# EAGLE schematic 副機插座 v0.4v1.0 (EAGLE 6.3)
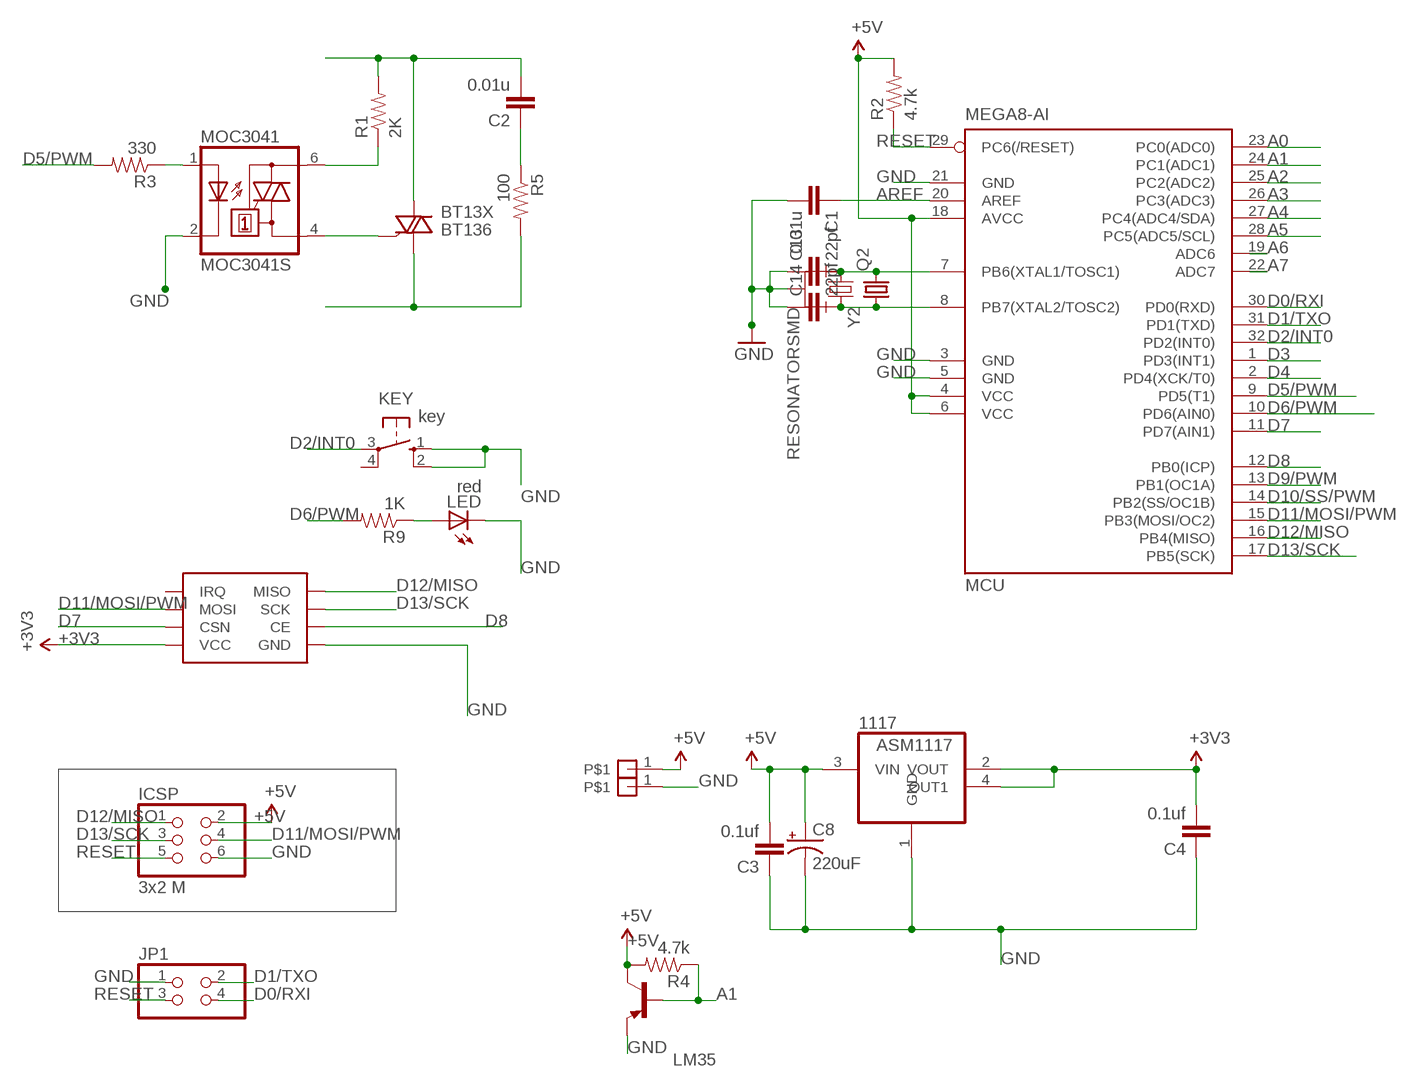
[diagram p0: schematic, sheet 1]

## Parts
1117  ASM1117  [SOT223]
BT13X  BT136  [TO252]
C1  0.01u  CAP0603-CAP  [0603-CAP]
C2  0.01u  C-EU050-024X044  [C050-024X044]
C3  0.1uf  CAP0603-CAP  [0603-CAP]
C4  0.1uf  CAP0603-CAP  [0603-CAP]
C8  220uF  CAP_POL3528  [EIA3528]
C13  22pf  CAP0603-CAP  [0603-CAP]
C14  22pf  CAP0603-CAP  [0603-CAP]
ICSP  3x2 M  PINHD-2X3  [2X03]
JP1  PINHD-2X2  [2X02]
KEY  key  10-XX  [B3F-10XX]
LED  red  LED3MM  [LED3MM]
LM35  -PNP-TO92-E1  [TO92-E1]
MCU  MEGA8-AI  [TQFP32-08]
MOC3041  MOC3041S  [DIL6-SMD]
Q2  CRYSTALHC49S  [HC49/S]
R1  2K  RESISTORPTH1  [AXIAL-0.3]
R2  4.7k  RESISTOR0603-RES  [0603-RES]
R3  330  RESISTOR0603-RES  [0603-RES]
R4  4.7k  RESISTOR0603-RES  [0603-RES]
R5  100  RESISTORPTH1  [AXIAL-0.3]
R9  1K  RESISTOR0603-RES  [0603-RES]
U$3  PIN1  [PIN1]
U$4  PIN1  [PIN1]
U$6  NRF  [NRF]
Y2  RESONATORSMD  [RESONATOR-SMD]

## Nets
+3V3: 1117.2(VOUT) 1117.4(OUT1) C4.2 U$6.P$2(VCC)
+5V: 1117.3(VIN) C3.2 C8.A(+) ICSP.2 LM35.1(C) MCU.4(VCC) MCU.6(VCC) MCU.18(AVCC) R2.2 R4.2 U$3.1
A0: MCU.23(PC0(ADC0))
A1: LM35.2(B) MCU.24(PC1(ADC1)) R4.1
A2: MCU.25(PC2(ADC2))
A3: MCU.26(PC3(ADC3))
A4: MCU.27(PC4(ADC4/SDA))
A5: MCU.28(PC5(ADC5/SCL))
A6: MCU.19(ADC6)
A7: MCU.22(ADC7)
AREF: C1.1 MCU.20(AREF)
D0/RXI: JP1.4 MCU.30(PD0(RXD))
D1/TXO: JP1.2 MCU.31(PD1(TXD))
D2/INT0: KEY.3(P) MCU.32(PD2(INT0))
D3: MCU.1(PD3(INT1))
D4: MCU.2(PD4(XCK/T0))
D5/PWM: MCU.9(PD5(T1)) R3.2
D6/PWM: MCU.10(PD6(AIN0)) R9.2
D7: MCU.11(PD7(AIN1)) U$6.P$4(CSN)
D8: MCU.12(PB0(ICP)) U$6.P$3(CE)
D9/PWM: MCU.13(PB1(OC1A))
D10/SS/PWM: MCU.14(PB2(SS/OC1B))
D11/MOSI/PWM: ICSP.4 MCU.15(PB3(MOSI/OC2)) U$6.P$6(MOSI)
D12/MISO: ICSP.1 MCU.16(PB4(MISO)) U$6.P$7(MISO)
D13/SCK: ICSP.3 MCU.17(PB5(SCK)) U$6.P$5(SCK)
GND: 1117.1(GND) C1.2 C3.1 C4.1 C8.C(-) C13.1 C14.1 ICSP.6 JP1.1 KEY.1(S) KEY.2(S1) LED.K(C) LM35.3(E) MCU.3(GND) MCU.5(GND) MCU.21(GND) MOC3041.2(C) U$4.1 U$6.P$1(GND) Y2.2
IN: BT13X.3(A2) C2.2 R1.P$2
N$1: MOC3041.6(A2) R1.P$1
N$2: BT13X.2(G) MOC3041.4(A1)
N$3: C2.1 R5.P$1
N$15: LED.A R9.1
N$34: C13.2 MCU.7(PB6(XTAL1/TOSC1)) Q2.2 Y2.1
N$35: C14.2 MCU.8(PB7(XTAL2/TOSC2)) Q2.1 Y2.3
OUT: BT13X.1(A1) R5.P$2
P1: MOC3041.1(A) R3.1
RESET: ICSP.5 JP1.3 MCU.29(PC6(/RESET)) R2.1
Unconnected: KEY.4(P1) U$6.P$8(IRQ)

## Library data of the parts
1117 = MY3:ASM1117: 800mA and 1A Low Dropout (LDO) Positive Regulator 1.8V, 2.5V, 2.85V, 3.3V, 5V, and Adj; MPN: REG1117; OC_FARNELL: 1097566; OC_NEWARK: 14P6981
BT13X = PKJ:BT136: Triac BT136 series E sensitive gate Source: http://www.nxp.com/acrobat_download/datasheets/BT136_SERIES_E_2.pdf
C1 = MY2:CAP: Capacitor Standard 0603 ceramic capacitor, and 0.1" leaded capacitor.
C2 = resistor:C-EU: CAPACITOR, European symbol
C3 C4 = MY:CAP: Capacitor Standard 0603 ceramic capacitor, and 0.1" leaded capacitor.
C8 = MY:CAP_POL: Capacitor Polarized These are standard SMD and PTH capacitors. Normally 10uF, 47uF, and 100uF in electrolytic and tantalum varieties. Always verify the external diameter of the through hole cap, it varies with capacity, voltage, and manufacturer. The EIA devices should be standard.
C13 C14 = 00my:CAP: Capacitor Standard 0603 ceramic capacitor, and 0.1" leaded capacitor.
ICSP = SmartPrj:PINHD-2X3: PIN HEADER
JP1 = pinhead:PINHD-2X2: PIN HEADER
KEY = switch-omron:10-XX: OMRON SWITCH; MPN: B3F-1000; OC_FARNELL: 176432; OC_NEWARK: 36M3542
LED = led:LED: LED OSRAM: - CHIPLED LG R971, LG N971, LY N971, LG Q971, LY Q971, LO R971, LY R971 LH N974, LH R974 LS Q976, LO Q976, LY Q976 LO Q996 - Hyper CHIPLED LW Q18S LB Q993, LB Q99A, LB R99A - SideLED LS A670, LO A670, LY A670, LG A670, LP A670 LB A673, LV A673, LT A673, LW A673 LH A674 LY A675 LS A676, LA A676, LO A676, LY A676, LW A676 LS A679, LY A679, LG A679 - Hyper Micro SIDELEDR LS Y876, LA Y876, LO Y876, LY Y876 LT Y87S - SmartLED LW L88C, LW L88S LB L89C, LB L89S, LG L890 LS L89K, LO L89K, LY L89K LS L896, LA L896, LO L896, LY L896 - TOPLED LS T670, LO T670, LY T670, LG T670, LP T670 LSG T670, LSP T670, LSY T670, LOP T670, LYG T670 LG T671, LOG T671, LSG T671 LB T673, LV T673, LT T673, LW T673 LH T674 LS T676, LA T676, LO T676, LY T676, LB T676, LH T676, LSB T676, LW T676 LB T67C, LV T67C, LT T67C, LS T67K, LO T67K, LY T67K, LW E67C LS E67B, LA E67B, LO E67B, LY E67B, LB E67C, LV E67C, LT E67C LW T67C LS T679, LY T679, LG T679 LS T770, LO T770, LY T770, LG T770, LP T770 LB T773, LV T773, LT T773, LW T773 LH T774 LS E675, LA E675, LY E675, LS T675 LS T776, LA T776, LO T776, LY T776, LB T776 LHGB T686 LT T68C, LB T68C - Hyper Mini TOPLEDR LB M676 - Mini TOPLED SantanaR LG M470 LS M47K, LO M47K, LY M47K Source: http://www.osram.convergy.de LUXEON: - LUMILEDR LXK2-PW12-R00, LXK2-PW12-S00, LXK2-PW14-U00, LXK2-PW14-V00 LXK2-PM12-R00, LXK2-PM12-S00, LXK2-PM14-U00 LXK2-PE12-Q00, LXK2-PE12-R00, LXK2-PE12-S00, LXK2-PE14-T00, LXK2-PE14-U00 LXK2-PB12-K00, LXK2-PB12-L00, LXK2-PB12-M00, LXK2-PB14-N00, LXK2-PB14-P00, LXK2-PB14-Q00 LXK2-PR12-L00, LXK2-PR12-M00, LXK2-PR14-Q00, LXK2-PR14-R00 LXK2-PD12-Q00, LXK2-PD12-R00, LXK2-PD12-S00 LXK2-PH12-R00, LXK2-PH12-S00 LXK2-PL12-P00, LXK2-PL12-Q00, LXK2-PL12-R00 Source: www.luxeon.com KINGBRIGHT: KA-3528ASYC Source: www.kingbright.com
LM35 = transistor-neu-to92:*-PNP-: PNP Transistror
MCU = atmel:MEGA8: MICROCONTROLLER 8 Kbytes FLASH, 1 kbytes SRAM, 512 bytes EEPROM, USART, 6-channel 10 bit ADC, 2-channel 8 bit ADC Pin compatible with Atmega48, ATMega88, ATMega168 Source: avr.lbr; MPN: ATMEGA8-16AU; OC_FARNELL: 9171371; OC_NEWARK: 73M8863
MOC3041 = optocoupler:MOC30*: 6-Pin DIP Zero-Cross Optoisolators Triac Driver Output (250/400 Volt Peak) Source: http://www.fairchildsemi.com/ds/MO/MOC3043-M.pdf; MF: FAIRCHILD SEMICONDUCTOR; MPN: MOC3041S-M; OC_FARNELL: unknown; OC_NEWARK: 05C2885
Q2 = crystal:CRYSTAL: CRYSTAL; OC_FARNELL: 1667008; OC_NEWARK: unknown
R1 R5 = MY3:RESISTOR: Resistor Basic schematic elements and footprints for 0603, 1206, and PTH 1/10th watt (small) resistors.
R2-R4 R9 = MY:RESISTOR: Resistor Basic schematic elements and footprints for 0603, 1206, and PTH 1/10th watt (small) resistors.
U$3 U$4 = PKJ:PIN1
U$6 = PKJ:NRF
Y2 = MY:RESONATOR: Resonator Small SMD resonator. This is the itty bitty 10/20MHz resonators with built in caps. CSTCE10M0G55 and CSTCE20M0V53. Footprint has been reviewed closely but hasn't been tested yet.

## Net classes
1 power: width 0.381 mm
2 gnd: width 0.305 mm, drill 0.559 mm, clearance 0.254 mm
3 usbvcc: width 0.508 mm, drill 0.61 mm, clearance 0.254 mm